# EAGLE design roduinoRF (EAGLE 6.2)
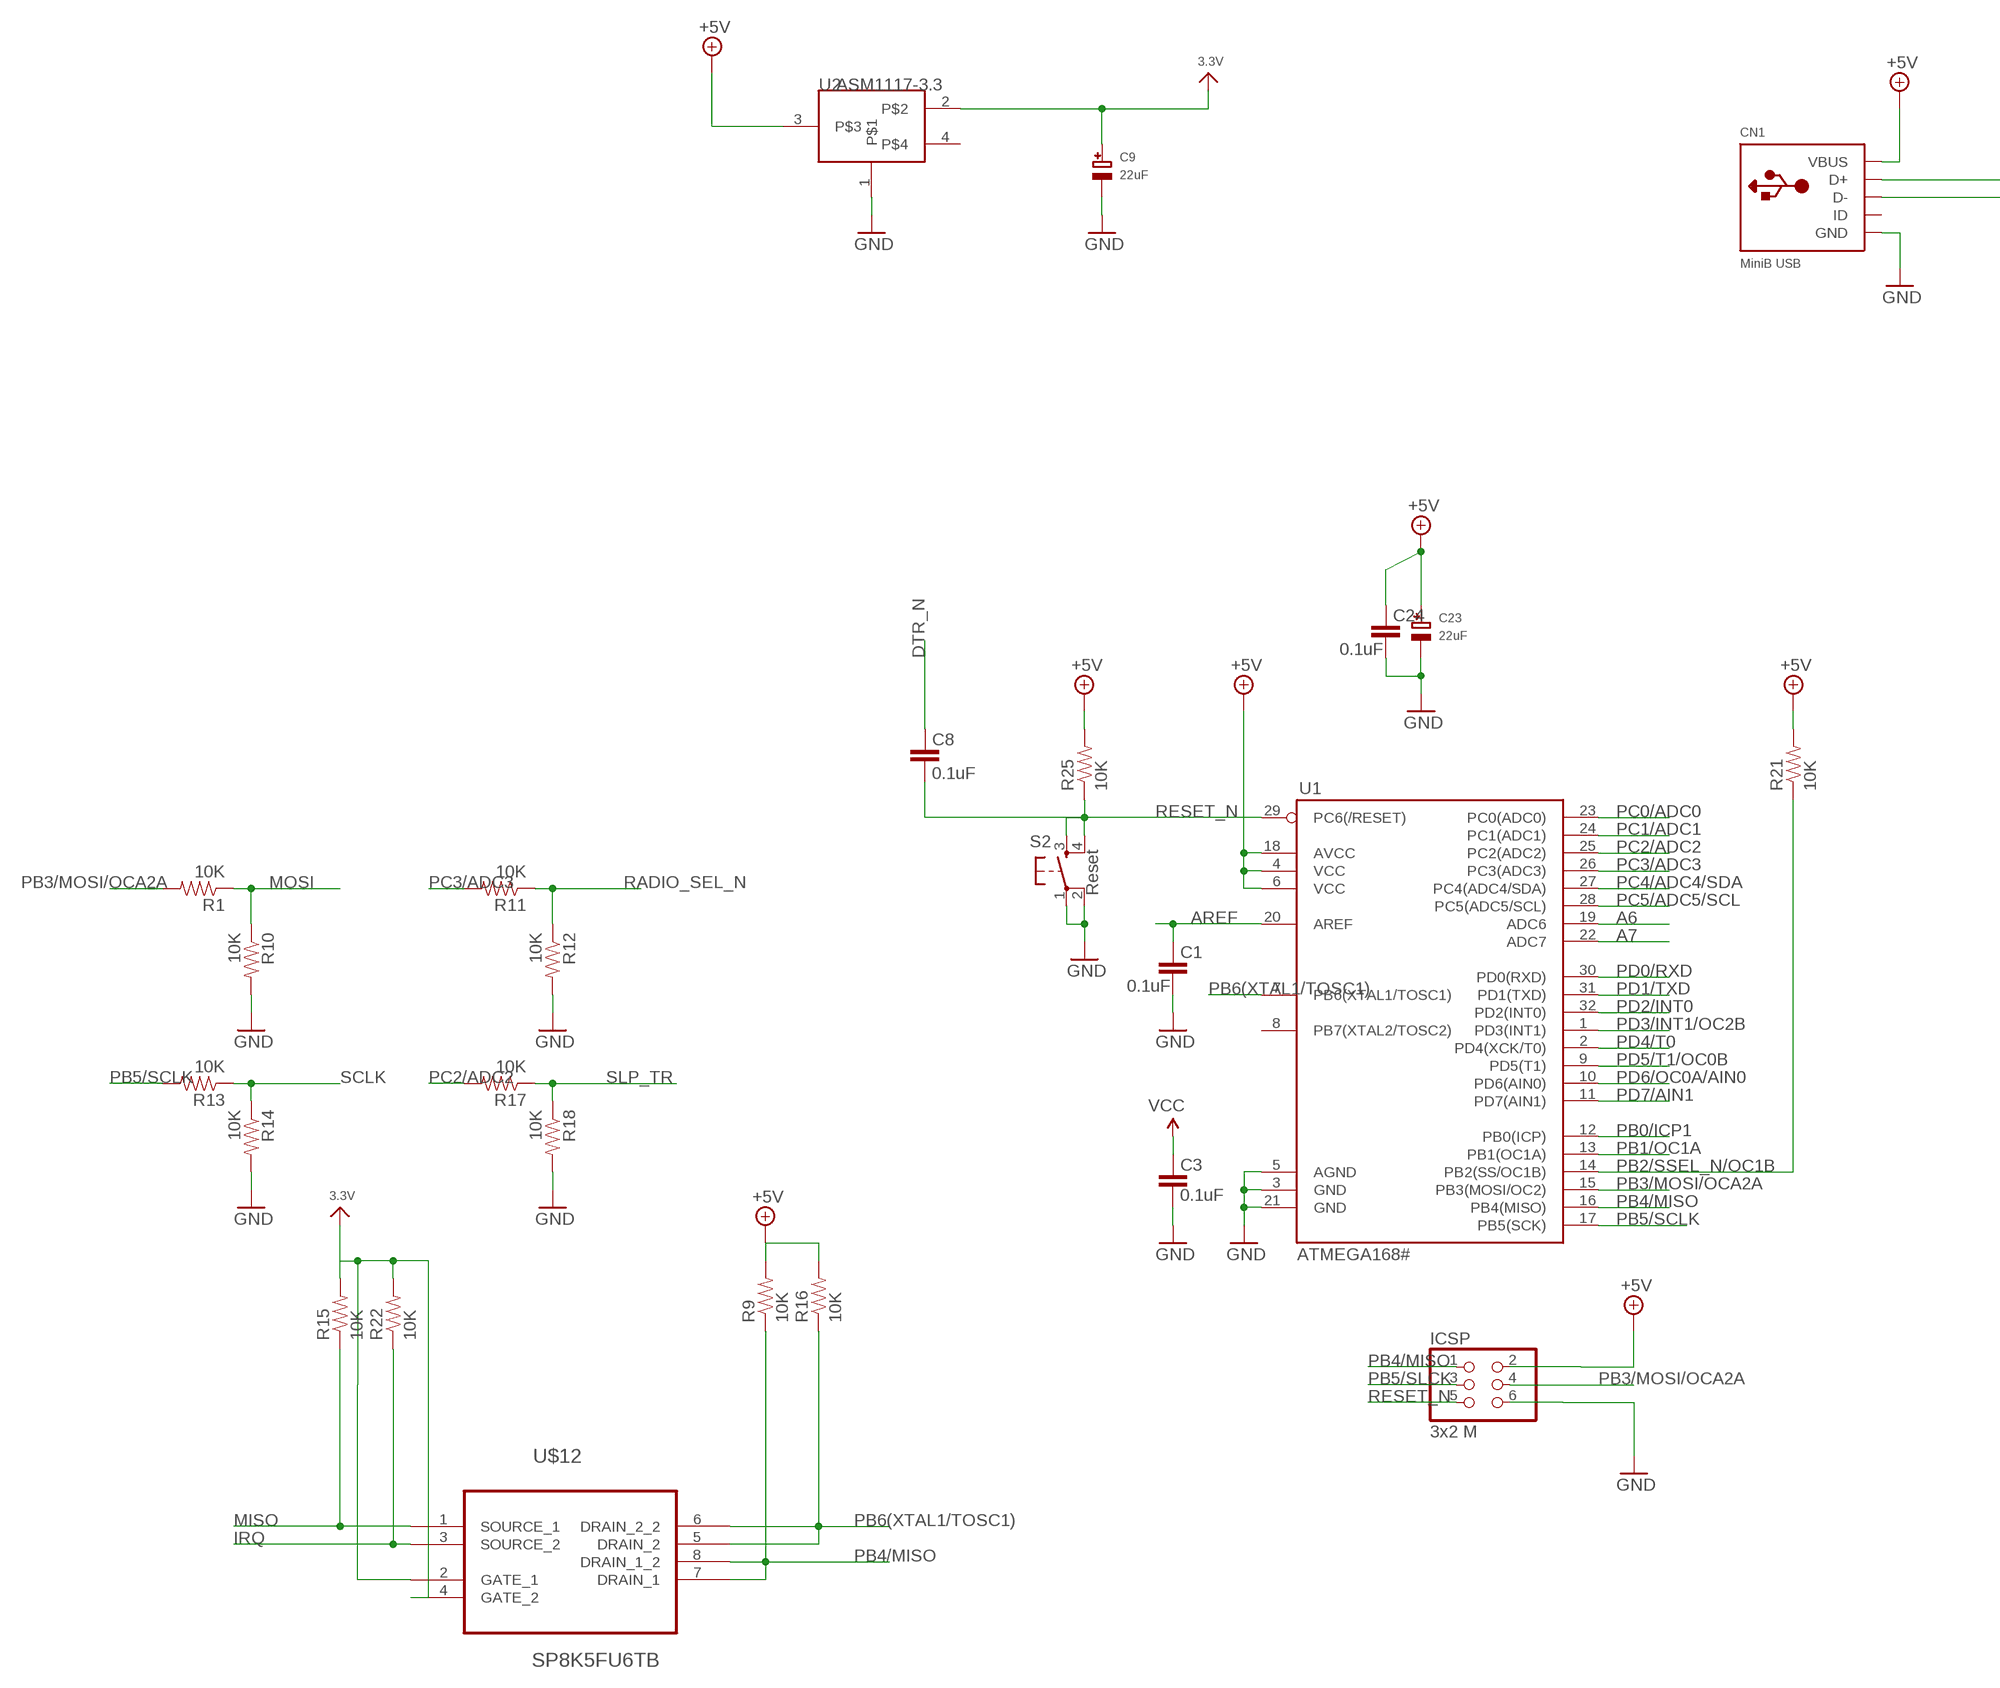
[diagram p0: schematic, sheet 1, part 1 of 2]
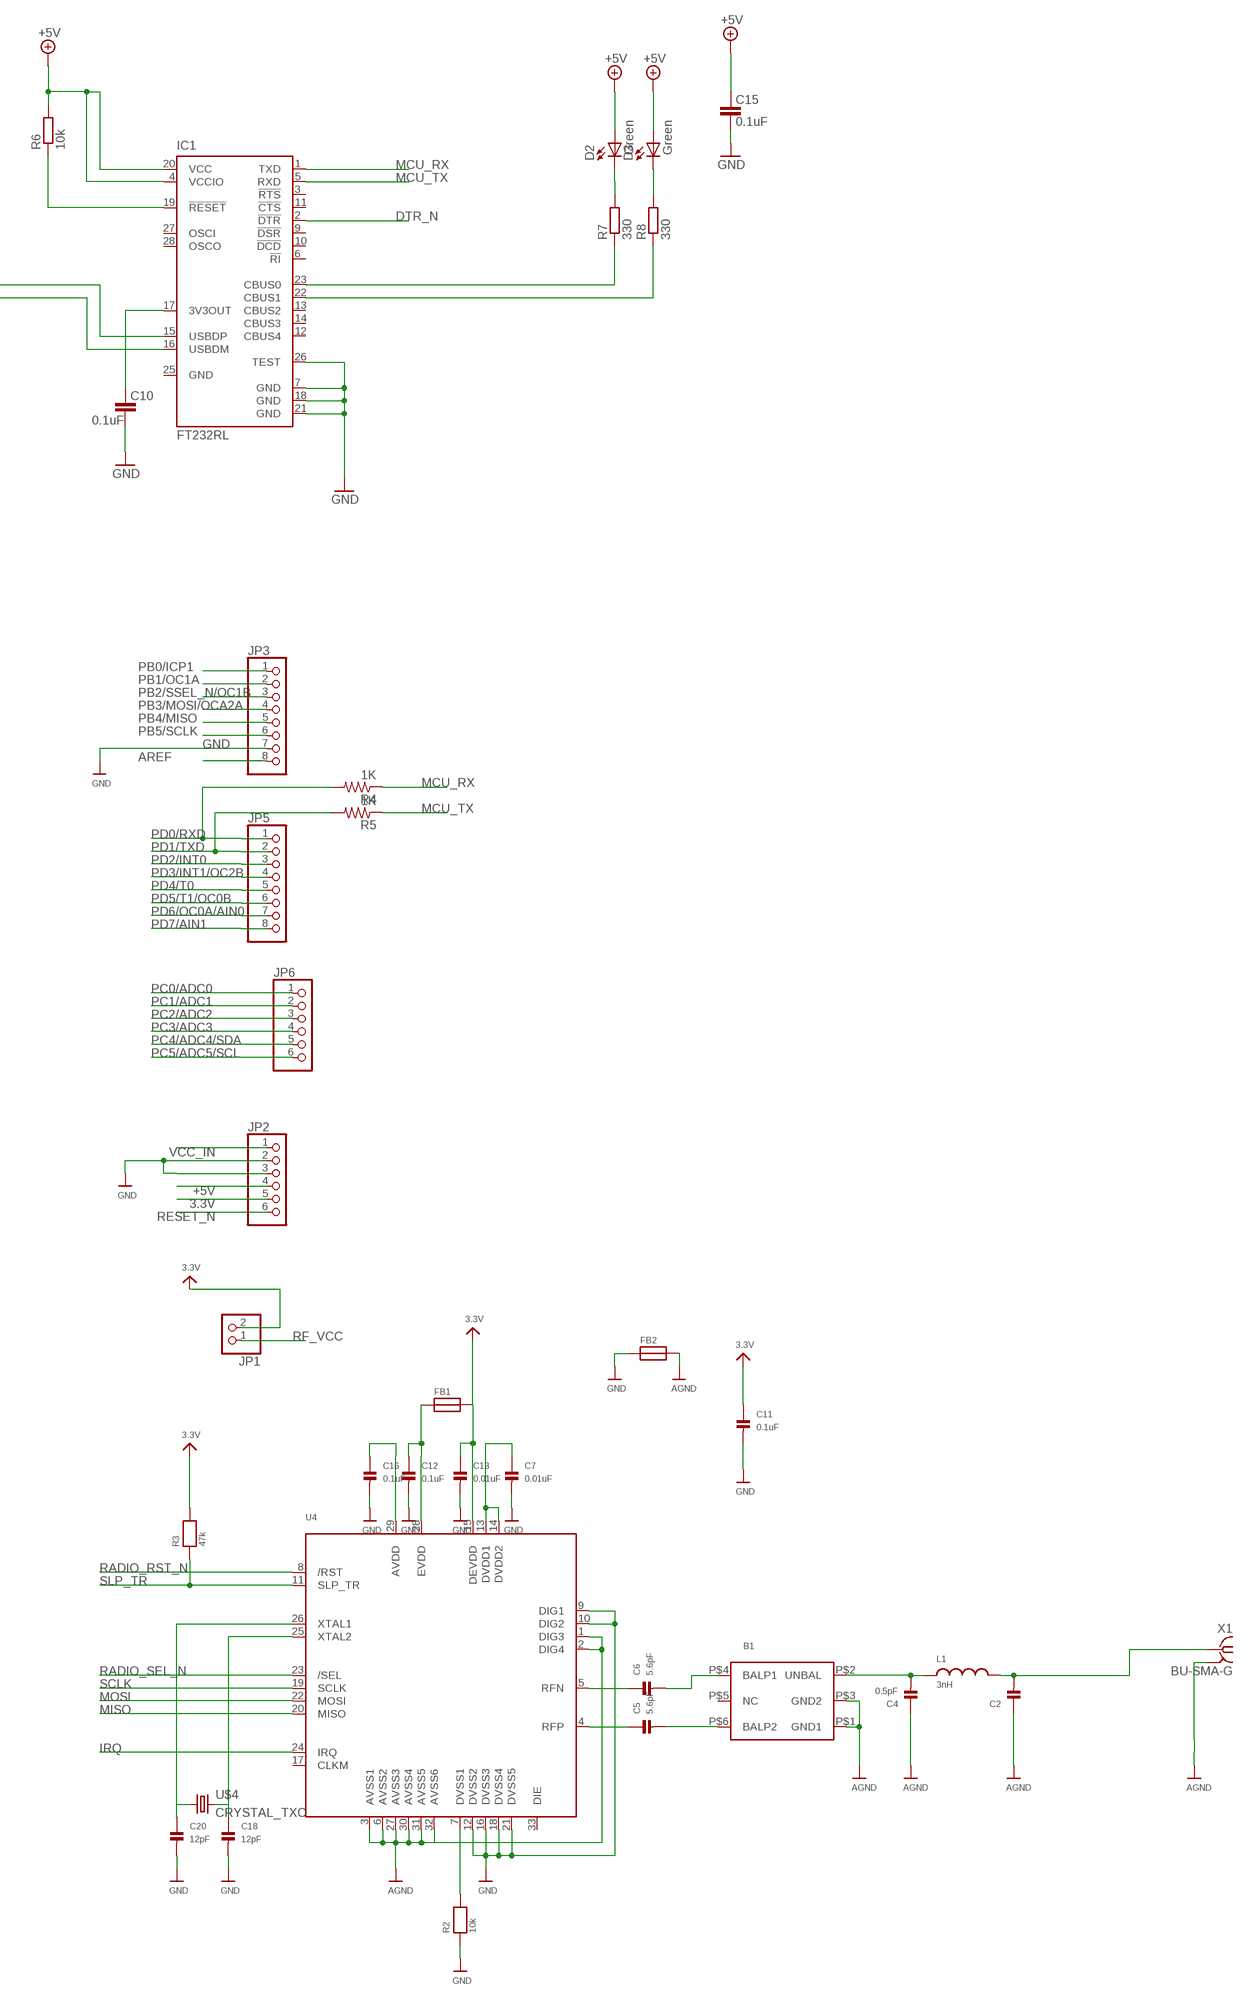
[diagram p1: schematic, sheet 1, part 2 of 2]

## Parts
B1  BALUN  [BALUN1206]
C1  0.1uF  CAP0805  [0805]
C2  CAP_CERAMIC0805  [0805]
C3  0.1uF  CAP0805  [0805]
C4  0.5pF  CAP_CERAMIC0805  [0805]
C5  5.6pF  CAP_CERAMIC0805  [0805]
C6  5.6pF  CAP_CERAMIC0805  [0805]
C7  0.01uF  CAP_CERAMIC0805  [0805]
C8  0.1uF  CAP0805  [0805]
C9  22uF  CAP_ELECTROLYTICPANASONIC_C  [PANASONIC_C]
C10  0.1uF  CAP0805  [0805]
C11  0.1uF  CAP_CERAMIC0805  [0805]
C12  0.1uF  CAP_CERAMIC0805  [0805]
C13  0.01uF  CAP_CERAMIC0805  [0805]
C15  0.1uF  CAP0805  [0805]
C16  0.1uF  CAP_CERAMIC0805  [0805]
C18  12pF  CAP_CERAMIC0805  [0805]
C20  12pF  CAP_CERAMIC0805  [0805]
C23  22uF  CAP_ELECTROLYTICPANASONIC_C  [PANASONIC_C]
C24  0.1uF  CAP0805  [0805]
CN1  MiniB USB  USBMINIB  [USB-MINIB]
D2  Green  LED0603  [LED-0603]
D3  Green  LED0603  [LED-0603]
FB1  FERRITE  [0603]
FB2  FERRITE  [0603]
IC1  FT232RL  [SSOP28]
ICSP  3x2 M  PINHD-2X3  [2X03]
JP1  PINHD-1X2  [1X02]
JP2  PINHD-1X6  [1X06]
JP3  PINHD-1X8  [1X08]
JP5  PINHD-1X8  [1X08]
JP6  PINHD-1X6  [1X06]
L1  3nH  INDUCTOR0805  [0805]
R1  10K  RESISTOR  [0805]
R2  10k  RESISTOR0805  [0805]
R3  47k  RESISTOR0805  [0805]
R4  1K  RESISTOR  [0805]
R5  1K  RESISTOR  [0805]
R6  10k  R-EU_R0603  [R0603]
R7  330  R-EU_R0805  [R0805]
R8  330  R-EU_R0805  [R0805]
R9  10K  RESISTOR  [0805]
R10  10K  RESISTOR  [0805]
R11  10K  RESISTOR  [0805]
R12  10K  RESISTOR  [0805]
R13  10K  RESISTOR  [0805]
R14  10K  RESISTOR  [0805]
R15  10K  RESISTOR  [0805]
R16  10K  RESISTOR  [0805]
R17  10K  RESISTOR  [0805]
R18  10K  RESISTOR  [0805]
R21  10K  RESISTOR  [0805]
R22  10K  RESISTOR  [0805]
R25  10K  RESISTOR  [0805]
S2  Reset  TAC_SWITCHSMD  [TACTILE_SWITCH_SMD]
U1  ATMEGA168#  ATMEGA168  [TQFP32-08]
U2  ASM1117-3.3  [SOT223]
U4  AT86RF212  [32QN2]
U$4  CRYSTAL_TXC  [CRYSTAL_TCX]
U$12  SP8K5FU6TB  [SOP127P600X175-8N]
X1  BU-SMA-G  [BU-SMA-G]

## Nets
3.3V: C9.+ JP1.2 JP2.5 R15.2 R22.2 U2.2 U$12.2(GATE_1) U$12.4(GATE_2)
+5V: C3.2 C15.2 C23.+ C24.2 CN1.VBUS D2.A D3.A IC1.4(VCCIO) IC1.20(VCC) ICSP.2 JP2.4 R6.2 R9.2 R16.2 R21.2 R25.2 U1.4(VCC) U1.6(VCC) U1.18(AVCC) U2.3 ; supply symbol labelled VCC
A6: U1.19(ADC6)
A7: U1.22(ADC7)
AGND: B1.P$1(GND1) B1.P$3(GND2) C2.1 C4.1 FB2.2 U4.1(DIG3) U4.2(DIG4) U4.3(AVSS1) U4.6(AVSS2) U4.27(AVSS3) U4.30(AVSS4) U4.31(AVSS5) U4.32(AVSS6) X1.2(GND)
AREF: C1.2 JP3.8 U1.20(AREF)
DTR_N: C8.2 IC1.2(!DTR)
GND: C1.1 C3.1 C7.2 C9.- C10.1 C11.2 C12.2 C13.2 C15.1 C16.2 C18.2 C20.2 C23.- C24.1 CN1.GND FB2.1 IC1.7(GND) IC1.18(GND) IC1.21(GND) IC1.26(TEST) ICSP.6 JP2.2 JP2.3 JP3.7 R2.1 R10.2 R12.2 R14.2 R18.2 S2.1 S2.2 U1.3(GND) U1.5(AGND) U1.21(GND) U2.1 U4.9(DIG1) U4.10(DIG2) U4.12(DVSS2) U4.16(DVSS3) U4.18(DVSS4) U4.21(DVSS5)
GND1: D2.C R7.2
IRQ: R22.1 U4.24(IRQ) U$12.3(SOURCE_2)
MCU_RX: IC1.1(TXD) R4.1
MCU_TX: IC1.5(RXD) R5.1
MISO: R15.1 U4.20(MISO) U$12.1(SOURCE_1)
MOSI: R1.1 R10.1 U4.22(MOSI)
N$1: CN1.D+ IC1.15(USBDP)
N$2: CN1.D- IC1.16(USBDM)
N$3: IC1.23(CBUS0) R7.1
N$4: IC1.19(!RESET) R6.1
N$5: IC1.22(CBUS1) R8.1
N$6: D3.C R8.2
N$12: C10.2 IC1.17(3V3OUT)
N$17: C6.1 U4.5(RFN)
N$20: C5.1 U4.4(RFP)
N$21: B1.P$4(BALP1) C6.2
N$22: B1.P$6(BALP2) C5.2
N$23: B1.P$2(UNBAL) C4.2 L1.1
N$24: C2.2 L1.2 X1.1
N$26: C20.1 U4.26(XTAL1) U$4.1
N$27: C18.1 U4.25(XTAL2) U$4.2
N$28: R2.2 U4.7(DVSS1)
N$29: C7.1 U4.13(DVDD1) U4.14(DVDD2)
N$30: C12.1 FB1.1 U4.28(EVDD)
N$31: C16.1 U4.29(AVDD)
PB0/ICP1: JP3.1 U1.12(PB0(ICP))
PB1/OC1A: JP3.2 U1.13(PB1(OC1A))
PB2/SSEL_N/OC1B: JP3.3 R21.1 U1.14(PB2(SS/OC1B))
PB3/MOSI/OCA2A: ICSP.4 JP3.4 R1.2 U1.15(PB3(MOSI/OC2))
PB4/MISO: ICSP.1 JP3.5 R9.1 U1.16(PB4(MISO)) U$12.7(DRAIN_1) U$12.8(DRAIN_1_2)
PB5/SCLK: JP3.6 R13.2 U1.17(PB5(SCK))
PB5/SLCK: ICSP.3
PB6(XTAL1/TOSC1): R16.1 U1.7(PB6(XTAL1/TOSC1)) U$12.5(DRAIN_2) U$12.6(DRAIN_2_2)
PC0/ADC0: JP6.1 U1.23(PC0(ADC0))
PC1/ADC1: JP6.2 U1.24(PC1(ADC1))
PC2/ADC2: JP6.3 R17.2 U1.25(PC2(ADC2))
PC3/ADC3: JP6.4 R11.2 U1.26(PC3(ADC3))
PC4/ADC4/SDA: JP6.5 U1.27(PC4(ADC4/SDA))
PC5/ADC5/SCL: JP6.6 U1.28(PC5(ADC5/SCL))
PD0/RXD: JP5.1 R4.2 U1.30(PD0(RXD))
PD1/TXD: JP5.2 R5.2 U1.31(PD1(TXD))
PD2/INT0: JP5.3 U1.32(PD2(INT0))
PD3/INT1/OC2B: JP5.4 U1.1(PD3(INT1))
PD4/T0: JP5.5 U1.2(PD4(XCK/T0))
PD5/T1/OC0B: JP5.6 U1.9(PD5(T1))
PD6/OC0A/AIN0: JP5.7 U1.10(PD6(AIN0))
PD7/AIN1: JP5.8 U1.11(PD7(AIN1))
RADIO_RST_N: U4.8(/RST)
RADIO_SEL_N: R11.1 R12.1 U4.23(/SEL)
RESET_N: C8.1 ICSP.5 JP2.6 R25.1 S2.3 S2.4 U1.29(PC6(/RESET))
RF_VCC: C11.1 C13.1 FB1.2 JP1.1 R3.2 U4.15(DEVDD) ; supply symbol labelled 3.3V
SCLK: R13.1 R14.1 U4.19(SCLK)
SLP_TR: R3.1 R17.1 R18.1 U4.11(SLP_TR)
VCC_IN: JP2.1
Unconnected: B1.P$5(NC) CN1.ID IC1.3(!RTS) IC1.6(!RI) IC1.9(!DSR) IC1.10(!DCD) IC1.11(!CTS) IC1.12(CBUS4) IC1.13(CBUS2) IC1.14(CBUS3) IC1.27(OSCI) IC1.28(OSCO) U1.8(PB7(XTAL2/TOSC2)) U2.4 U4.17(CLKM) U4.33(DIE)

## Power pins joined to a net without a drawn wire
GND: IC1.25(GND) X1.3(GND) X1.4(GND) X1.5(GND)

## Library data of the parts
B1 = microbuilder:BALUN: BALUN - Baluns for RF 1206 800-1000MHz Balun (1206) - Digikey: 712-1023-1-ND
C1 C3 C8 C10 C15 C24 = SparkFun:CAP: Capacitor Standard 0603 ceramic capacitor, and 0.1" leaded capacitor.
C2 C4-C7 C11-C13 C16 C18 C20 = microbuilder:CAP_CERAMIC: Ceramic Capacitors 0402 - 0402 Surface Mount Capacitors 16pF 50V 5% [Digikey: 445-4899-2-ND] 18pF 50V 5% [Digikey: 490-1281-2-ND] 22pF 50V 5% [Digikey: 490-1283-2-ND] 68pF 50V 5% [Digikey: 490-1289-2-ND] 0.1uF 10V 10% [Digikey: 490-1318-2-ND] 1.0uF 6.3V 10% [Digikey: 490-1320-2-ND] 0603 - 0603 Surface Mount Capacitors 16 pF 50V 5% [Digikey: 445-5051-2-ND] 22 pF 50V [Digikey: PCC220ACVTR-ND] 33 pF 50V 5% [Digikey: 490-1415-1-ND] 56pF 50V 5% [Digikey: 490-1421-1-ND] 220pF 50V 5% [Digikey: 445-1285-1-ND] 680 pF 50V 2200 pF 50V 5% C0G [Digikey: 445-1297-1-ND] 5600 pF 100V 5% X7R [Digikey: 478-3711-1-ND] 0.1 µF 25V 10% [Digikey: PCC2277TR-ND] 0.22 µF 16V 10% X7R [Digikey: 445-1318-1-ND] 1.0 µF 25V 10% [Digikey: 445-5146-2-ND] 0603 - RF Specific 3pF 250V +/-0.1pF RF [Digikey: 712-1347-1-ND] 18 pF 250V 5% [Digikey: 478-3505-1-ND or 712-1322-1-ND] 56 pF 250V 5% C0G RF [Digikey: 490-4867-1-ND] 68 pF 250V RF [Digikey: 490-4868-1-ND] 0805 - 0805 Surface Mount Capacitors 220 pF 250V 2% RF Ceramic Capacitor [Digikey: 712-1398-1-ND] 1000 pF 50V 2% NP0 Ceramic Capacitor [Digikey: 478-3760-1-ND] 0.1 µF 25V 10% Ceramic Capacitor [Digikey: PCC1828TR-ND] 1.0 µF 16V 10% Ceramic Capacitor[Digikey: 490-1691-2-ND] 10.0 µF 10V 10% Ceramic Capacitor[Digikey: 709-1228-1-ND] 10.0 uF 16V 10% Ceramic Capacitor [Digikey: 478-5165-2-ND] 47 uF 6.3V 20% Ceramic Capacitor [Digikey: 587-1779-1-ND or 399-5506-1-ND] 1206 - 1206 Surface Mount Capacitors 47uF 10V 20% Ceramic Capacitor [Digikey: 490-5528-1-ND or 399-5508-1-ND or 445-6010-1-ND]
C9 C23 = microbuilder:CAP_ELECTROLYTIC: Electrolytic Capacitors PANASONIC_C - Size C Panasonic Electrolytic Aluminum Capacitor 47µF 16V 20% Electrolytic Capacitor [Digikey: PCE3890TR-ND] PANASONIC_D - Size D Panasonic Electrolytic Aluminum Capacitor 100µF 25V 20% Electrolytic Capacitor [Digikey: PCE3898TR-ND]
CN1 = adafruit:USB: USB Connectors USBMINIB - Surface Mount Female Mini-B USB Connector 4UConnector: 06564 By microbuilder.eu Thru-hole RA Female Mini-B USB Connector 4UConnector: 18732 By ladyada.net
D2 D3 = SparkFun:LED: LEDs Standard schematic elements and footprints for 5mm, 3mm, 1206, and 0603 sized LEDs. 5mm - Spark Fun Electronics SKU : COM-00529 (and others)
FB1 FB2 = microbuilder:FERRITE: Ferrite Bead 0603 MMZ1608B121C - 120 Ohm, 600mA Ferrite Chip - Digikey: 445-2164-1-ND BK1608HW121-T - 120 Ohm, 600mA Ferrite Chip - Digikey: 587-1876-2-ND
IC1 = ftdichip:FT232R: Source: http://www.ftdichip.com/Documents/DataSheets/DS_FT232R_v104.pdf; MPN: FT232RL; OC_FARNELL: 1146032; OC_NEWARK: 91K9918
ICSP = SmartPrj:PINHD-2X3: PIN HEADER
JP1 = pinhead:PINHD-1X2: PIN HEADER
JP2 JP6 = pinhead:PINHD-1X6: PIN HEADER
JP3 JP5 = pinhead:PINHD-1X8: PIN HEADER
L1 = microbuilder:INDUCTOR: Inductors 0603: 10nH Ceramic Inductor - microwire antenna/RF (Digikey: 712-1434-2-ND) 0805: 560nH Ceramic Inductor - RF (Digikey: 553-1047-1-ND) 1007 (2518 Metric) SMT: 10µH 10% 250mOhm 820mA 1007 Inductor (Digikey: 587-2189-1-ND) 22µH 10% 500mOhm 580mA 1007 Inductor (Digikey: 587-2190-1-ND) 47µH 10% 950mOhm 420mA 1007 Inductor (Digikey: 587-2191-1-ND) 47µH 5% 100mOhm 1A 1008 Inductor (Digikey: 732-1816-1-ND) 6.0x6.0mm: 4.7µH 20% 3.8A 27mOhm Inductor (Digikey: 445-6538-2-ND)
R1 R4 R5 R9-R18 R21 R22 R25 = SparkFun:RESISTOR: Resistor Basic schematic elements and footprints for 0603, 1206, and PTH 1/10th watt (small) resistors.
R2 R3 = microbuilder:RESISTOR: Resistors 0402 - 0402 Surface Mount Package 22 Ohm 1% 1/16W [Digikey: 311-22.0LRTR-ND] 33 Ohm 5% 1/16W 1.0K 5% 1/16W 1.5K 5% 1/16W 2.0K 1% 1/16W 10.0K 1% 1/16W [Digikey: 311-10.0KLRTR-ND] 10.0K 5% 1/16W [Digikey: RMCF0402JT10K0TR-ND] 12.1K 1% 1/16W [Digikey: 311-22.0LRTR-ND] 100.0K 5% 1/16W 0603 - 0603 Surface Mount Package 0 Ohm 1/10 Watt 1% Resistor 15 Ohm 1/10 Watt 1% Resistor 33 Ohm 1/10 Watt 1% Resistor 49.9 Ohm 1/10 Watt 1% Resistor 100 Ohm 1/10 Watt 1% Resistor 150 Ohm 1/10 Watt 1% Resistor 240 Ohm 1/10 Watt 1% Resistor 390 Ohm 1/10 Watt 1% Resistor 560 Ohm 1/10 Watt 1% Resistor 680 Ohm 1/10 Watt 1% Resistor 750 Ohm 1/10 Watt 1% Resistor 1.0K Ohm 1/10 Watt 1% Resistor 1.5K Ohm 1/10 Watt 1% Resistor 2.0K Ohm 1/10 Watt 1% Resistor 2.2K Ohm 1/10 Watt 1% Resistor 3.3K Ohm 1/10 Watt 1% Resistor 4.7K Ohm 1/10 Watt 1% Resistor 10.0K Ohm 1/10 Watt 1% Resistor 12.0K Ohm 1/10 Watt 1% Resistor 12.1K Ohm 1/10 Watt 1% Resistor 20.0K Ohm 1/10 Watt 1% Resistor 33.0K Ohm 1/10 Watt 1% Resistor 100.0K Ohm 1/10 Watt 1% Resistor 0805 - 0805 Surface Mount Package 0 Ohm 1/8 Watt 1% Resistor 33 Ohm 1/8 Watt 1% Resistor 100 Ohm 1/8 Watt 1% Resistor 150 Ohm 1/8 Watt 1% Resistor 200 Ohm 1/8 Watt 1% Resistor 240 Ohm 1/8 Watt 1% Resistor 330 Ohm 1/8 Watt 1% Resistor 390 Ohm 1/8 Watt 1% Resistor 470 Ohm 1/8 Watt 1% Resistor 1.0K Ohm 1/8 Watt 1% Resistor 1.5K Ohm 1/8 Watt 1% Resistor 2.0K Ohm 1/8 Watt 1% Resistor 4.7K Ohm 1/8 Watt 1% Resistor 5.1K Ohm 1/8 Watt 1% Resistor 5.6K Ohm 1/8 Watt 1% Resistor 10.0K Ohm 1/8 Watt 1% Resistor 22.0K Ohm 1/8 Watt 1% Resistor 33.0K Ohm 1/8 Watt 1% Resistor 100K Ohm 1/8 Watt 1% Resistor 1206 - 1206 Surface Mount Package 2012 - 2010 Surface Mount Package 0.11 Ohm 1/2 Watt 1% Resistor - Digikey: RHM.11UCT-ND
R6-R8 = rcl:R-EU_: RESISTOR, European symbol
S2 = SparkFun:TAC_SWITCH: Momentary Switch Button commonly used for reset or general input. Spark Fun Electronics SKU : COM-00097
U1 = SparkFun:ATMEGA168
U2 = Itead_IC_110429:ASM1117-3.3: ICP006
U4 = microbuilder:AT86RF212: AT86RF212 - Low-Power SPI-based 700/800/900 MHz Transceiver Digikey: AT86RF212-ZU-ND
U$4 = crystal_txc:CRYSTAL_TXC: TXC - 7A-16.000MAAJ-T - XTAL, 16.000MHZ, 18PF, SMD, 5.0X3.2
U$12 = DUAL_MOSFET:SP8K5FU6TB
X1 = con-coax:BU-SMA-G: FEMALE SMA CONNECTOR Radiall distributor RS 193-9117; OC_FARNELL: unknown; OC_NEWARK: unknown

## Net classes
1 power: width 0.61 mm, drill 0.61 mm, clearance 0.254 mm
2 gnd: width 0.305 mm, drill 0.559 mm, clearance 0.254 mm
3 usbvcc: width 0.508 mm, drill 0.61 mm, clearance 0.254 mm

## Board
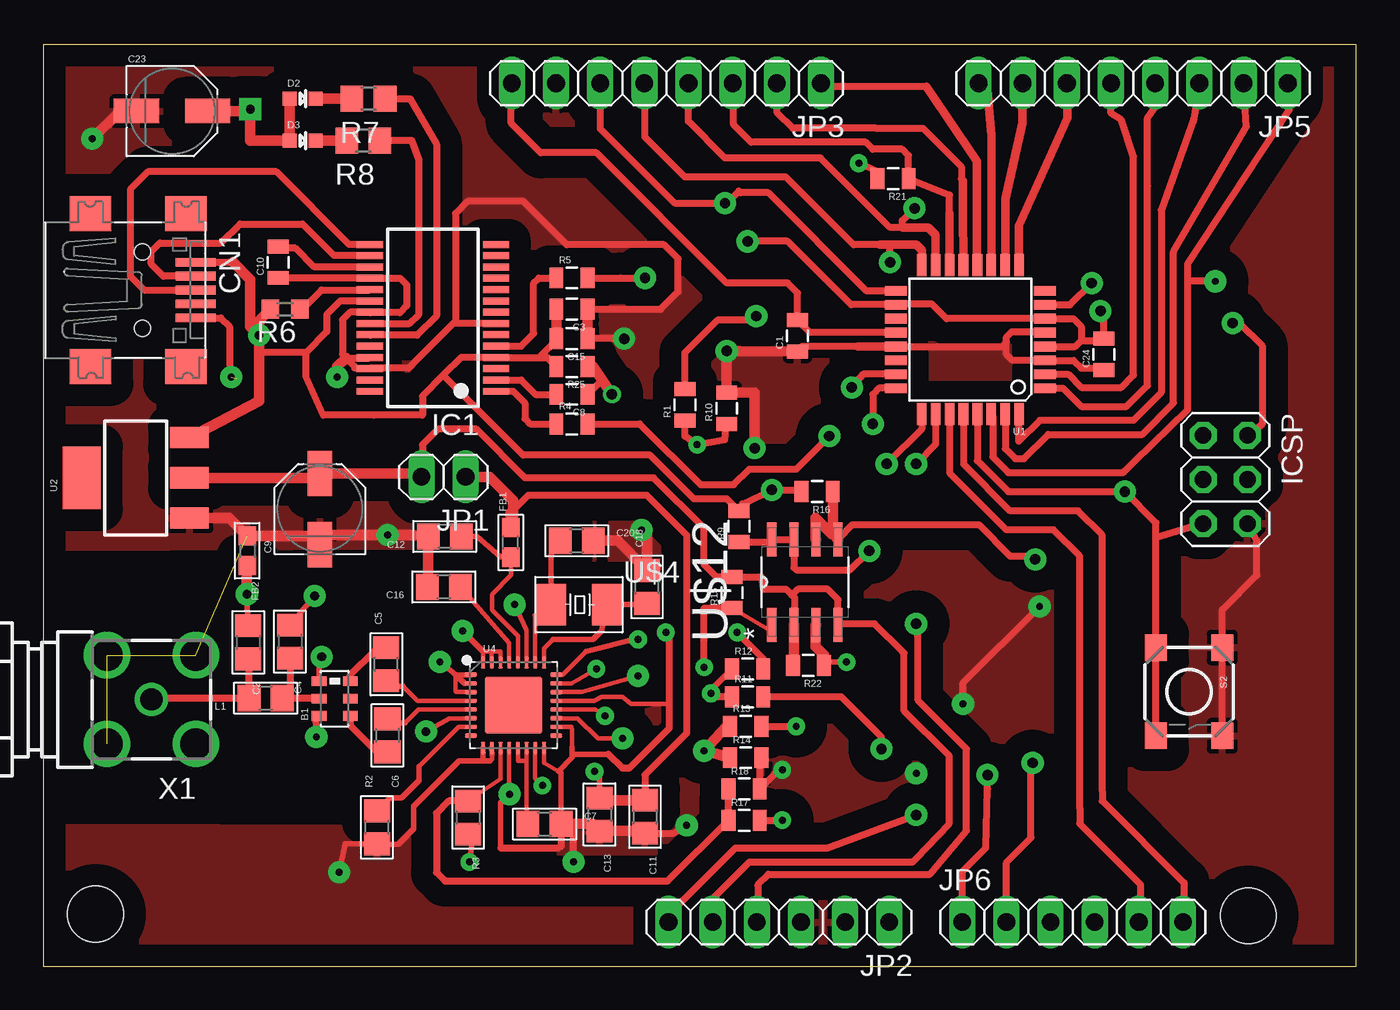
[diagram p2: board, top side]
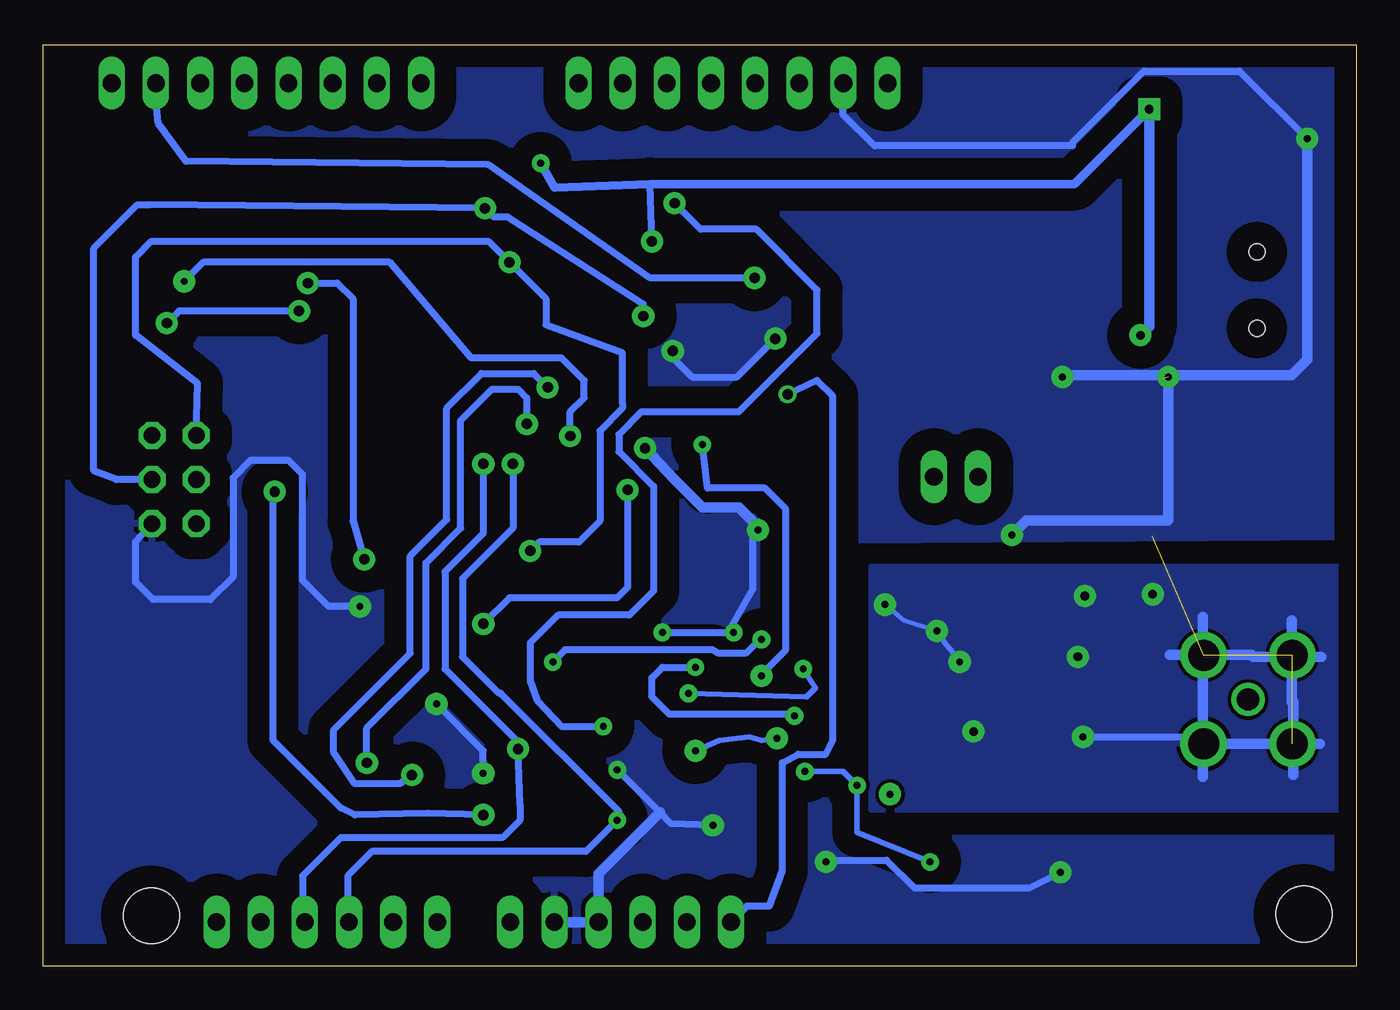
[diagram p3: board, bottom side, seen from below]

Size 75.5 x 53 mm. Coordinates in mm from the lower left corner, seen from the top.
Outline: 0,0 75.5,0 75.5,53 0,53 0,0
Copper layers (1*16): Top 0.035mm / dielectric 1.5mm / Bottom 0.035mm
Design rules: minimum track width 10mil, minimum drill 24mil, track to track 8mil, track to pad 8mil, pad to pad 8mil, via to via 8mil, smd to smd 8mil, copper to edge 40mil, drill to drill 8mil, minimum pad ring 10mil, minimum via ring 8mil, stop-mask expansion 4mil, vias tented up to drill 0mil, thermal gap 10mil
Holes 3.2 mm at 3,3 69.3,2.9

### Footprints (pad centres in the part's own frame; a part is rotated, then mirrored left to right if it is on the bottom)
BALUN1206 = smd 0.55 x 0.85: P$1 1,0.9; P$2 0,0.9; P$3 -1,0.9; P$4 -1,-0.9; P$5 0,-0.9; P$6 1,-0.9
0805 = smd 0.8 x 1.2: 1 -0.9,0; 2 0.9,0
0805' = smd 1.3 x 1.5: 1 -0.95,0; 2 0.95,0
PANASONIC_C = smd 2.6 x 1.4: + 2.05,0; - -2.05,0
USB-MINIB = smd 0.5 x 2.308: D+ 0,4.064; D- -0.8,4.064; GND 1.6,4.064; ID 0.8,4.064; VBUS -1.6,4.064 | smd 2 x 2.4: GND1 -4.4,-2; GND2 -4.4,3.5; GND3 4.4,3.5; GND4 4.4,-2 | hole 0.9: -2.2,1; 2.2,1
LED-0603 = smd 0.8 x 0.8: A 0,-0.75; C 0,0.75
0603 = smd 1.1 x 1: 1 -0.85,0; 2 0.85,0
SSOP28 = smd 0.4 x 1.5: 1 -4.225,-3.625; 2 -3.575,-3.625; 3 -2.925,-3.625; 4 -2.275,-3.625; 5 -1.625,-3.625; 6 -0.975,-3.625; 7 -0.325,-3.625; 8 0.325,-3.625; 9 0.975,-3.625; 10 1.625,-3.625; 11 2.275,-3.625; 12 2.925,-3.625; 13 3.575,-3.625; 14 4.225,-3.625; 15 4.225,3.625; 16 3.575,3.625; 17 2.925,3.625; 18 2.275,3.625; 19 1.625,3.625; 20 0.975,3.625; 21 0.325,3.625; 22 -0.325,3.625; 23 -0.975,3.625; 24 -1.625,3.625; 25 -2.275,3.625; 26 -2.925,3.625; 27 -3.575,3.625; 28 -4.225,3.625
2X03 = drill 0.95 pad 1.55 octagon: 1 -2.54,-1.27; 2 -2.54,1.27; 3 0,-1.27; 4 0,1.27; 5 2.54,-1.27; 6 2.54,1.27
1X02 = drill 1.016 long: 1 -1.27,0; 2 1.27,0
1X06 = drill 1.016 long: 1 -6.35,0; 2 -3.81,0; 3 -1.27,0; 4 1.27,0; 5 3.81,0; 6 6.35,0
1X08 = drill 1.016 long: 1 -8.89,0; 2 -6.35,0; 3 -3.81,0; 4 -1.27,0; 5 1.27,0; 6 3.81,0; 7 6.35,0; 8 8.89,0
R0603 = smd 1 x 1.1: 1 -0.85,0; 2 0.85,0
R0805 = smd 1.3 x 1.5: 1 -0.95,0; 2 0.95,0
TACTILE_SWITCH_SMD = smd 1.524 x 1.27: 1 -2.54,1.905; 2 2.54,1.905; 3 -2.54,-1.905; 4 2.54,-1.905
TQFP32-08 = smd 1.27 x 0.559: 1 -4.293,2.8; 2 -4.293,2; 3 -4.293,1.2; 4 -4.293,0.4; 5 -4.293,-0.4; 6 -4.293,-1.2; 7 -4.293,-2; 8 -4.293,-2.8; 17 4.293,-2.8; 18 4.293,-2; 19 4.293,-1.2; 20 4.293,-0.4; 21 4.293,0.4; 22 4.293,1.2; 23 4.293,2; 24 4.293,2.8 | smd 0.559 x 1.27: 9 -2.8,-4.293; 10 -2,-4.293; 11 -1.2,-4.293; 12 -0.4,-4.293; 13 0.4,-4.293; 14 1.2,-4.293; 15 2,-4.293; 16 2.8,-4.293; 25 2.8,4.293; 26 2,4.293; 27 1.2,4.293; 28 0.4,4.293; 29 -0.4,4.293; 30 -1.2,4.293; 31 -2,4.293; 32 -2.8,4.293
SOT223 = smd 1.219 x 2.235: 1 -2.311,-3.099; 2 0,-3.099; 3 2.311,-3.099 | smd 3.6 x 2.2: 4 0,3.099
32QN2 = smd 0.7 x 0.25: 1 -2.45,1.75; 2 -2.45,1.25; 3 -2.45,0.75; 4 -2.45,0.25; 5 -2.45,-0.25; 6 -2.45,-0.75; 7 -2.45,-1.25; 8 -2.45,-1.75; 17 2.45,-1.75; 18 2.45,-1.25; 19 2.45,-0.75; 20 2.45,-0.25; 21 2.45,0.25; 22 2.45,0.75; 23 2.45,1.25; 24 2.45,1.75 | smd 0.25 x 0.7: 9 -1.75,-2.45; 10 -1.25,-2.45; 11 -0.75,-2.45; 12 -0.25,-2.45; 13 0.25,-2.45; 14 0.75,-2.45; 15 1.25,-2.45; 16 1.75,-2.45; 25 1.75,2.45; 26 1.25,2.45; 27 0.75,2.45; 28 0.25,2.45; 29 -0.25,2.45; 30 -0.75,2.45; 31 -1.25,2.45; 32 -1.75,2.45 | smd 3.3 x 3.3: 33 0,0
CRYSTAL_TCX = smd 1.7 x 2.4: 1 -1.6,0; 2 1.6,0
SOP127P600X175-8N = smd 1.956 x 0.533: 1 -2.464,1.905; 2 -2.464,0.635; 3 -2.464,-0.635; 4 -2.464,-1.905; 5 2.464,-1.905; 6 2.464,-0.635; 7 2.464,0.635; 8 2.464,1.905
BU-SMA-G = drill 1.27: 1 0,0 | drill 1.778: 2 -2.55,2.55; 3 2.55,2.55; 4 2.55,-2.55; 5 -2.55,-2.55

### Placement (x,y rotation side)
B1  16.75,15.4 90 top
C1  43.37,36.27 90 top
C2  [0805']  11.78,18.63 270 top
C3  30.4,37.8 180 top
C4  0.5pF  [0805']  14.18,18.68 270 top
C5  5.6pF  [0805']  19.72,17.37 90 top
C6  5.6pF  [0805']  19.78,13.28 270 top
C7  0.01uF  [0805']  28.82,8.18 0 top
C8  30.4,32.9 180 top
C9  15.9,26.3 90 top
C10  13.5,40.5 90 top
C11  0.1uF  [0805']  34.6,8.6 270 top
C12  0.1uF  [0805']  23.08,24.72 180 top
C13  0.01uF  [0805']  31.98,8.73 270 top
C15  30.4,36.1 180 top
C16  0.1uF  [0805']  23.03,21.82 180 top
C18  12pF  [0805']  34.72,21.82 90 top
C20  12pF  [0805']  30.67,24.48 0 top
C23  7.4,49.2 0 top
C24  61,35.2 90 top
CN1  4.7,38.9 270 top
D2  14.9,49.9 270 top
D3  14.9,47.5 270 top
FB1  26.88,24.38 90 top
FB2  11.72,23.9 270 top
IC1  22.4,37.3 90 top
ICSP  67.98,28 270 top
JP1  23.01,28.15 180 top
JP2  42.3,2.54 180 top
JP3  35.84,50.8 180 top
JP5  62.68,50.8 180 top
JP6  59.2,2.54 0 top
L1  3nH  [0805']  12.78,15.42 180 top
R1  36.9,32.3 90 top
R2  10k  [0805']  19.18,7.99 90 top
R3  47k  [0805']  24.42,8.56 270 top
R4  30.4,31.2 0 top
R5  30.4,39.6 0 top
R6  13.9,37.8 180 top
R7  18.7,49.9 180 top
R8  18.4,47.5 180 top
R9  40,25.3 90 top
R10  39.3,32.1 90 top
R11  40.5,15.5 0 top
R12  40.5,17.1 0 top
R13  40.4,13.8 0 top
R14  40.4,12 0 top
R15  39.6,21.5 90 top
R16  44.5,27.3 180 top
R17  40.3,8.4 0 top
R18  40.3,10.2 0 top
R21  48.87,45.32 180 top
R22  44,17.3 180 top
R25  30.4,34.5 180 top
S2  65.9,15.8 270 top
U1  53.32,36.05 180 top
U2  5.3,28.1 90 top
U4  27.04,15.02 0 top
U$4  30.8,20.8 0 top
U$12  43.8,22.1 90 top
X1  6.21,15.34 180 top

### Tracks (layer width: path | path; a pad name or v marks a point on that pad's centre or on a via)
3.3V
  Top 0.406: 43.05,21.35 42.7,21.7 41.4,21.7 41.3,22.4 R15.2 38.7,22.4 38,23.1 38,25.2 35.1,28.1 27.7,28.1 24.9,30.9 22.7,30.9 21.8,30 21.8,28.21 JP1.2 | 43.05,21.35 43.2,21.2 43.2,19.67 U$12.2 | 43.05,21.35 43.4,21.7 45.1,21.7 45.7,21.09 U$12.4 45.77,19.7 47.8,19.7 49.4,18.1 49.5,18 49.5,14.7 52.1,12.1 52.1,8.2 50.2,6.2 50,6 40.6,6 38.49,3.89 JP2.5
  Top 0.61: U2.2 16.05,28.1 C9.+ 21.04,28.35 JP1.2 | U$12.2 43.16,17.36 R22.2
+5V  (via drill 0.4 pad 1.02, 0.5 pad 1.27, 0.6 pad 1.27)
  Top 0.254: R9.2 40.1,26.2 40.2,26.3
  Top 0.406: CN1.VBUS 10.9,40.5 | IC1.20 17.07,38.27 16.3,37.5 16.3,36.5 15.1,35.3 | 15.1,35.3 12.6,35.3 12.4,35.5 | 23,34 24.02,35.02 IC1.4 28.5,35.02 | 23,34 21.8,32.8 21.8,31.7 19,31.7 16.1,31.7 15.1,33.9 15.1,35.3 | 28.5,35.02 28.98,35.02 R25.2 | C15.2 29.5,36.02 28.5,35.02 | 41.9,27.6 v41.9,27.4 | v41.9,27.4 43.5,27.4 R16.2 | 23,34 27.6,29.4 34.9,29.4 37.4,26.9 39.3,26.9 R9.2 | U1.4 59.35,35.65 59.7,36 | 59.7,36 60.9,36 C24.2 61,37.5 v60.8,37.7 | 59.7,36 59.7,36.8 59.25,37.25 U1.6 51.95,37.25 51.1,38.1 49.07,38.1 U1.18 46.45,38.05 42.8,41.7 v40.5,41.7 | R21.2 47.98,45.72 v46.9,46.2 | JP2.4 41.1,2.61 41.1,4.6 41.1,4.7 41.7,5.3 51,5.3 53.1,7.8 53.1,12.5 50.3,15.3 50.3,19.6 v50.2,19.7 | 40.2,26.3 40.2,26.6 v41.9,27.4 | v68.4,37 68.8,37 70.1,35.7 70.1,31.17 ICSP.2
  Top 0.61: D2.A D3.A 11.9,47.5 v11.9,49.3 11.8,49.2 C23.+ | v12.4,36.3 12.4,37.15 R6.2 | 10.9,40.5 11.9,39.5 11.9,36.8 v12.4,36.3 | v12.4,36.3 12.4,35.5 12.4,32.51 U2.3 | C15.2 C3.2
  Bottom 0.406: v40.5,41.7 40.6,45 46.1,44.8 | v41.9,27.4 41.9,21.8 42.5,21.2 46,21.2 48.7,21.2 v50.2,19.7 | v60.8,37.7 67.7,37.7 v68.4,37
  Bottom 0.5: v46.9,46.2 46.1,44.8 40.6,45 16.2,45 v11.9,49.3
  Bottom 0.61: v11.9,49.3 11.9,36.8 v12.4,36.3
AGND  (via drill 0.4 pad 1.27, 0.5 pad 1.27)
  Top 0.254: U4.32 25.29,18.11 25.3,18.1 25.8,18.1 | U4.2 24.23,16.27 | U4.3 23.73,15.77 23.7,15.8 23.7,16.74 | U4.6 23.37,14.27 v22,13.5 | U4.27 27.79,19.31 v27.1,20.8 | U4.30 26.29,18.09 26.3,18.1 25.8,18.1 | U4.31 25.79,18.09 25.8,18.1
  Top 0.305: 25.29,18.11 v24.1,19.3 | U4.1 23.73,16.77 | 23.73,16.77 v22.8,17.5 | B1.P$1 15.85,17.65 v16,17.8 | C4.1 15.58,21.28 v15.6,21.3 | C2.1 11.68,21.38 v11.7,21.4 | 24.23,16.27 23.73,16.77 | 23.7,16.74 23.73,16.77
  Top 0.406: B1.P$3 15.65,14.25 v15.7,13.2
  Top 0.61: v11.7,21.4 11.7,23.03 FB2.2
  Bottom 0.254: v27.1,20.8 26,19.9 v24.1,19.3
  Bottom 0.305: v24.1,19.3 23.6,18.5 23.3,18.2 v22.8,17.5 | v11.7,21.4 12.1,21.4 11.9,21.2 | v22,13.5 22.5,13.6
  Bottom 0.406: v15.7,13.2 9.17,13.2 X1.2
  Bottom 0.61: 3.6,12.8 3.7,12.8 | 3.7,12.8 8.6,12.8 | 3.7,12.8 2.1,12.8 | 3.6,11 3.6,15.2 3.7,15.2 3.7,19.9 | 8.8,10.9 8.8,20 8.8,20.1 | 5.9,17.8 2,17.8 | 6,17.9 10.7,17.9
  pour Bottom: 0.5,9 27.9,9 27.9,23 0.7,23
AREF
  Top 0.406: U1.20 44.09,36.45 C1.2 43.37,38.73 42.8,39.3 39.3,39.3 31.8,46.8 28.6,46.8 26.9,48.5 26.9,50.75 JP3.8
DTR_N
  Top 0.406: IC1.2 27.48,33.73 28.3,32.9 C8.2
GND  (via drill 0.4 pad 1.02, 0.4 pad 1.27, 0.6 pad 1.27)  (4 unrouted)
  Top 0.254: 25.7,11.8 25.8,11.9 25.8,12.16 | 29.62,11.22 28.8,11.7 U4.16 | U4.18 30.37,13.77 30.4,13.6 30.4,12.6 | U4.12 26.79,9.89 | 30.5,8.3 30.42,8.3 30.3,8.18 | 25.29,11.91 25.29,11.81 25.3,11.8 | U4.21 31.67,15.27 32.1,15.5 33.3,15.5 33.8,15.1 35.9,15.1 36,15
  Top 0.305: U4.9 25.29,11.91 | 25.7,11.8 25.4,11.8 25.3,11.8 23.9,11.8 21.3,9.2 21.3,7.9 20.4,7 19.22,7 R2.1 17.34,7.04 v17,5.4 | 25.8,12.16 U4.10 | U4.16 | 30.4,12.2 30.4,12.6 30.4,12.2 | 30.4,12.2 30.4,12 29.62,11.22 29.77,11.13 C7.2 29.8,8.15 | 26.79,9.89 26.3,9.4 26.3,6.8 | 32.5,12.2 30.4,12.2 | 17.88,34.38 17.95,34.45
  Top 0.406: C10.1 13.53,39.58 IC1.18 20.52,39.58 20.9,39.2 20.9,38 20.5,37.6 18.8,37.6 IC1.21 17.62,37.62 17.2,37.2 17.2,35.2 17.4,35 | 17.4,35 18.75,35 IC1.25 | 17.4,35 17.95,34.45 18.02,34.38 IC1.26 18.8,34.4 21,34.4 23.57,36.98 | 26.3,6.8 29.6,6.8 29.8,6.9 29.8,8.15 C7.2 | IC1.7 23.57,36.98 | CN1.GND 10.2,37.3 10.7,36.8 10.7,34 v10.8,33.9 | v30.5,6 30.5,8.3 | C11.2 36.25,7.65 v37,8.1 | v42.5,11.3 42.3,11.3 R18.2 41.2,11.9 R14.2 | R12.2 41.4,17.7 v39.9,19.2 | C24.1 60.9,34.4 59.7,34.4 59.25,34.85 U1.3 55.75,34.85 55.4,35.2 55.4,35.9 | 55.4,35.9 55.4,36.2 55.7,36.5 57.56,36.5 U1.5 | v33.4,36.1 C15.1 | 46.85,35.65 43.65,35.65 C1.1 | U1.21 55.15,35.65 55.4,35.9 | S2.2 S2.1 67.81,20.5 69.8,22.5 69.8,24.49 ICSP.6 | 11.1,33.8 11.2,33.7 | C3.1 35.5,37.8 36.5,38.8 36.5,40.7 35.7,41.5 30.1,41.5 27.6,44 24.4,44 23.7,43.3 23.7,37.1 23.57,36.98 | 32.5,12.2 33.3,11.4 33.7,11.4 36,13.7 36,15 36,19 v35.8,19.2 | v52.9,15.1 52.9,16.3 v57.3,20.7
  Top 0.5: U1.21 46.85,35.65
  Top 0.61: C7.2 30.3,8.18 31.58,8.18 C13.2 34.47,7.78 C11.2 | C20.2 33.01,24.48 C18.2 34.72,24.78 v34.4,25.1 | U2.1 10.68,25.79 FB2.1 15.4,24.75 C9.- 16.45,24.8 v19.8,24.8 21.05,24.8 C12.2 22.13,22.27 C16.2 | v2.8,47.6 4.4,49.2 C23.- 5.4,49.25 | C15.1 C3.1 | C1.1 v39.3,35.4 R10.2 40.9,33 v40.9,29.8 | 16.9,34 v16.9,33.9 16.9,34 | 16.9,34 16.9,34.5 17.4,35
  Bottom 0.406: 30.5,6.1 27,6.1 25.4,4.5 18.8,4.5 v17,5.4 | v37,8.1 39.4,8.2 40.05,8.85 42.4,11.2 v42.5,11.3 | v39.9,19.2 36.1,19.2 35.96,19.46 | 35.96,19.46 34.7,21.7 34.7,24.8 v34.4,25.1 | v39.3,35.4 39.3,35 38.2,33.9 35.6,33.9 v33.4,36.1 | v35.8,19.2 36,19.2 35.96,19.46 | v50.2,11.1 50.2,12.4 v52.9,15.1 | v57.3,20.7 59.1,20.7 60.6,22.2 60.6,28.3 61.4,29.1 63.6,29.1 64.6,28.1 64.6,22.4 65.9,21.1 69.2,21.1 70.2,22.1 70.2,24.43 ICSP.6 | JP3.7 29.5,50.79 29.5,49 27.7,47.2 16.3,47.2 16.3,47.4 12.2,51.5 6.7,51.5 v2.8,47.6
  Bottom 0.61: 40.05,8.85 42.4,6.5 43.57,5.33 JP2.3 JP2.2 | v10.8,33.9 10.8,25.67 10.84,25.64 18.96,25.64 v19.8,24.8 | v2.8,47.6 2.8,34.9 3.7,34 17,34 v16.9,33.9 | v34.4,25.1 34.4,25.3 35.5,26.4 37.6,26.4 39.2,28 v40.9,29.8
  pour Bottom (isolate 1.27): 0.7,0.2 99.8,0.2 99.4,55.7 0.1,55.7 0.3,24.7 29.1,24.5 28.9,7.4 0.8,7.4 0.5,0.1
  pour Top (isolate 1.27): 0.8,0.5 99.6,0.5 98.9,57.4 0.1,57.4 0.2,24.1 28.6,24.2 28.6,7.9 0.9,8 0.8,0.6
GND1
  Top 0.61: R7.2 D2.C
IRQ  (via drill 0.4 pad 1.02)
  Top 0.254: U4.24 29.87,16.77 31.2,18.1
  Top 0.305: 31.2,18.1 34.3,18.9 v34.2,18.8 | v46.2,17.5 44.7,17.5 R22.1
  Top 0.61: R22.1 44.9,17.9 44.4,18.4 44.4,19.6 U$12.3
  Bottom 0.305: 45.5,18.2 v46.2,17.5
  Bottom 0.406: v46.2,17.5 45.5,18.2 45.4,18.2 37,18.2 36.7,18 35.1,18 34.3,18.8 v34.2,18.8
MCU_RX
  Top 0.406: IC1.1 27.02,33.08 27.7,32.4 27.7,31.5 28,31.2 R4.1
MCU_TX
  Top 0.406: IC1.5 27.48,35.67 28.2,36.4 28.2,39.3 28.5,39.6 R5.1
MISO  (via drill 0.4 pad 1.02)
  Top 0.254: U4.20 31.73,14.77 v32.3,14.4 | R15.1 41.66,19.4 U$12.1
  Top 0.406: v38,17.2 38,18.9 38,20.6 39.7,20.6 R15.1
  Bottom 0.254: v32.3,14.4 32.8,14.5
  Bottom 0.406: 32.8,14.5 39.5,14.5 40.5,15.5 40.5,16.6 39.9,17.2 v38,17.2
MOSI  (via drill 0.4 pad 1.02, 0.4 pad 1.27)
  Top 0.254: U4.22 30.97,15.77 v34.2,16.7
  Top 0.406: R10.1 39.2,30.3 v37.6,30 36.9,30.5 R1.1
  Bottom 0.406: v37.6,30 37.3,27.5 34,27.5 32.8,26.3 32.8,18.2 34.2,16.8 v34.2,16.7
N$1
  Top 0.406: IC1.15 17.57,41.52 13.4,45.7 6,45.7 5,44.7 5,39.7 5.8,38.9 CN1.D+
N$2
  Top 0.406: CN1.D- 6.9,39.7 6.2,40.4 6.2,41.1 6.7,41.6 10.2,41.6 11.3,42.7 14.9,42.7 16.7,40.9 18.75,40.9 IC1.16
N$3
  Top 0.406: R7.1 21.1,49.9 22.6,47.3 22.6,37.4 21.5,36.3 18.8,36.3 IC1.23
N$4
  Top 0.406: R6.1 14.9,37.8 16,38.9 18.75,38.9 IC1.19
N$5
  Top 0.406: IC1.22 21.07,36.98 21.6,37.5 21.6,46.4 21.2,47.5 R8.1
N$6
  Top 0.61: R8.2 D3.C
N$7  (via drill 0.4 pad 1.27)
  other vias: 26.8,9.9
N$12
  Top 0.406: IC1.17 15.57,40.23 14.5,41.3 13.6,41.3 C10.2
N$17
  Top 0.254: U4.5 21.57,14.77 20.8,14
  Top 0.305: 20.8,14 20.01,14 C6.1
N$20
  Top 0.254: U4.4 21.53,15.27 20.7,16.1
  Top 0.305: 20.7,16.1 20.04,16.1 C5.1
N$21
  Top 0.406: B1.P$4 17.65,13.85 19.1,12.4 19.71,12.4 C6.2
N$22
  Top 0.406: B1.P$6 17.65,16.75 19.1,18.2 19.6,18.2 C5.2
N$23
  Top 0.406: C4.2 14.18,15.87 L1.1 13.75,15.4 B1.P$2
N$24
  Top 0.406: C2.2 11.83,17.63 L1.2 6.29,15.42 X1.1
N$26
  Top 0.254: U4.26 28.29,20.19
  Top 0.305: 28.29,20.19 U$4.1 29.2,23.66 C20.1
N$27
  Top 0.254: U4.25 28.79,18.29 29.3,18.8
  Top 0.305: C18.1 34.65,20.8 U$4.2 32.1,19.3 31.6,18.8 29.3,18.8
N$28
  Top 0.254: U4.7 23.87,13.77 22.8,12.7 21.6,11.5
  Top 0.305: 21.6,11.5 21.6,10.7 20.6,9.7 19.94,9.7 R2.2
N$29
  Top 0.254: U4.14 27.79,11.8 | 27.79,11.8 27.79,8.26 | U4.13 27.29,11.81 27.3,11.8 27.79,11.8
  Top 0.305: 27.79,8.26 C7.1
N$30
  Top 0.254: U4.28 27.29,18.81 27.29,19.01 25.8,20.5 25.8,21.4 26.9,22.5 26.9,23.51 FB1.1
  Top 0.305: 26.9,23.51 FB1.1 26.3,23.53 24.94,24.73 C12.1
N$31
  Top 0.254: U4.29 26.79,18.61 C16.1
PB0/ICP1
  Top 0.406: 50.79,50.61 44.92,50.61 JP3.1
  Top 0.5: 50.79,50.61 53.7,46.3 53.7,42.5 53.7,41.3 53.7,40.36 U1.12
PB1/OC1A
  Top 0.406: 52.9,45.2 52.8,45.3 52.8,46 50.6,48.2 47.9,48.2 43.1,48.2 42.2,49.1 42.2,50.79 JP3.2
  Top 0.5: U1.13 52.92,41.62 52.9,42.3 52.9,45.2
PB2/SSEL_N/OC1B
  Top 0.406: 52.12,43.33 52.12,44.37 R21.1 49.77,46.63 49.4,47 47.7,47 47.3,47.4 40.7,47.4 39.7,48.4 39.7,50.75 JP3.3
  Top 0.5: U1.14 52.12,43.33
PB3/MOSI/OCA2A  (via drill 0.6 pad 1.27)
  Top 0.406: v50.1,43.6 49.4,42.9 49.4,42.5 48.7,42.5 44.7,46.5 39.2,46.5 37.1,48.6 JP3.4 | R1.2 36.9,35.3 38.8,37.2 40.8,37.2 v41,37.4
  Top 0.5: U1.15 51.32,42.08 50.9,42.5 49.4,42.5
  Bottom 0.406: v41,37.4 41,38.1 48.8,43.1 49.6,43.1 v50.1,43.6 69.4,43.8 70.1,43.8 72.6,41.3 72.6,28.5 71.3,28 ICSP.4
PB4/MISO  (via drill 0.6 pad 1.27)
  Top 0.406: R9.1 41.73,24.4 U$12.8 U$12.7 43.16,22.93 43.3,22.8 46.4,22.8 v47.5,23.9 | v48.7,40.5 48.7,41.4 48.8,41.5 | 48.1,41.5 46.6,41.5 42.7,45.4 36.9,45.4 34.6,47.7 34.6,50.77 JP3.5
  Top 0.5: U1.16 50.52,41.18 50.2,41.5 48.8,41.5 48.1,41.5
  Bottom 0.406: v47.5,23.9 47,24.4 44.7,24.4 43.5,25.6 43.5,30.8 42.2,32.1 42.2,32.4 42.2,33.7 42.2,35.3 46.6,36.9 46.6,38.4 v48.7,40.5 49.9,41.7 69.3,41.7 70.2,40.8 70.2,36.3 66.63,33.53 ICSP.1
PB5/SCLK  (via drill 0.4 pad 1.02, 0.6 pad 1.27)
  Top 0.406: R13.2 v43.3,13.8 | U1.17 47.35,38.85 41.7,44.5 40.1,44.5 40,44.6 39.3,43.9 v39.2,43.9 36.3,43.9 32.03,48.17 JP3.6
  Bottom 0.406: v39.2,43.9 37.7,42.4 34.5,42.4 31,38.9 31,36.4 35.5,31.9 41.1,31.9 42.4,30.6 42.4,29.6 40.4,27.6 40.4,21.6 41.8,20.2 45.9,20.2 47.5,18.6 47.5,16.4 47.1,15.3 45.7,13.8 v43.3,13.8
PB6(XTAL1/TOSC1)  (via drill 0.6 pad 1.27)
  Top 0.406: U1.7 59.05,38.05 v60.3,39.3 | U$12.5 46.54,25.4 53.8,25.4 55.6,23.6 56.86,23.6 v57.05,23.41
  Top 0.61: R16.1 45.4,24.87 | 45.4,24.87 U$12.5 | 45.4,24.87 45.33,24.87 44.4,25.8 44.4,24.6 U$12.6
  Bottom 0.406: v60.3,39.3 58.6,39.3 57.7,38.4 57.7,25.6 v57.05,23.41
PC0/ADC0  (via drill 0.6 pad 1.27)
  Top 0.406: U1.23 47.15,34.05 v46.5,33.3 | v54.3,11 54.3,10.2 54.2,6.8 52.85,5.45 JP6.1
  Bottom 0.406: v54.3,11 54.2,11.1 55,10.5 57.6,10.5 58.8,12.3 58.8,13.6 54.4,18 54.4,23.6 52.3,25.7 52.3,32.1 50.3,34.1 47.3,34.1 v46.5,33.3
PC1/ADC1  (via drill 0.6 pad 1.27)
  Top 0.406: U1.24 48.05,33.25 47.7,32.9 47.7,31.5 v47.7,31.2 | v56.9,11.7 56.8,11.6 56.8,7.4 55.39,5.99 JP6.2
  Bottom 0.406: v56.9,11.7 56.9,13.7 53.5,17.1 53.5,23.2 51.5,25.2 51.5,31.4 49.7,33.2 48.2,33.2 47.7,32.7 v47.7,31.2
PC2/ADC2  (via drill 0.4 pad 1.02, 0.6 pad 1.27)
  Top 0.406: R17.2 v42.5,8.4 | U1.25 50.52,30.92 v48.5,28.9
  Bottom 0.406: v48.5,28.9 48.5,25.2 51.4,22.3 51.4,17.8 49.3,15.7 49.2,15.7 42.4,8.9 42.4,8.5 v42.5,8.4 44.3,6.6 56.6,6.6 58,5.2 58,2.61 JP6.3
PC3/ADC3  (via drill 0.6 pad 1.27)
  Top 0.406: U1.26 51.32,30.02 v50.2,28.9 | v48.2,12.5 48.2,13.2 45.9,15.5 R11.2
  Bottom 0.406: v50.2,28.9 50.2,24.9 52.4,22.7 52.4,17.1 50.6,15.3 48.2,12.9 v48.2,12.5 48.1,9.3 48.1,8.4 49.1,7.4 58.4,7.4 60.6,5.2 60.6,2.67 JP6.4
PC4/ADC4/SDA
  Top 0.406: U1.27 52.12,28.38 55.4,25.1 58.1,25.1 59.6,23.6 59.6,9.1 59.6,8.2 63.1,4.7 63.1,2.63 JP6.5
PC5/ADC5/SCL
  Top 0.406: U1.28 52.92,28.88 55.6,26.2 59.5,26.2 60.9,24.8 60.9,10.1 60.9,9.5 65.6,4.8 65.6,2.59 JP6.6
PD0/RXD  (via drill 0.4 pad 1.27, 0.6 pad 1.27)
  Top 0.406: R4.2 34.3,31.2 37.8,27.7 39.7,27.7 40.6,28.6 43.3,28.6 v45.2,30.5 | U1.30 54.6,31.68 54.6,29.3 55.5,28.4 62.1,28.4 62.2,28.5 62.71,29 65.8,32 65.8,39.3 | JP5.1 71.64,49.24 65.8,40.4 65.8,39.3 | v67.4,39.4 65.9,39.4 65.8,39.3
  Bottom 0.406: v45.2,30.5 45.2,31.9 44.4,32.7 44.4,33.7 45.7,35 50.9,35 55.6,40.5 66.3,40.5 v67.4,39.4
PD1/TXD  (via drill 0.6 pad 1.27)
  Top 0.406: U1.31 55.32,29.78 55.9,29.2 56.4,29.2 57.8,30.6 63.2,30.6 65,32.4 65,41.1 69.2,48.3 69.1,49.7 JP5.2 | R5.2 33.2,39.6 v34.6,39.6
  Bottom 0.406: v34.6,39.6 40.6,39.6 49.9,46.1 67.3,46.3 68.9,48.5 69,49.4 JP5.2
PD2/INT0
  Top 0.406: JP5.3 66.16,48.76 64.3,43.5 64.3,33 62.7,31.4 57.3,31.4 56.1,30.2 56.1,31.74 U1.32
PD3/INT1/OC2B
  Top 0.406: U1.1 58.65,33.25 59.7,32.2 62.3,32.2 63.5,33.4 63.5,44.9 63.5,48.8 64,49.52 JP5.4
PD4/T0
  Top 0.406: U1.2 58.95,34.05 59.7,33.3 62,33.3 62.7,34 62.7,46.6 62,48.7 61.4,49.08 JP5.5
PD5/T1/OC0B
  Top 0.5: U1.9 56.12,42.62 58.9,48.8 58.9,49.44 JP5.6
PD6/OC0A/AIN0
  Top 0.5: U1.10 55.32,44.12 56.3,48.5 JP5.7
PD7/AIN1
  Top 0.5: U1.11 54.52,47.82 54.3,50.4 54.3,50.74 JP5.8
RADIO_SEL_N  (via drill 0.4 pad 1.02)
  Top 0.254: U4.23 30.37,16.27 v31.8,17.1
  Top 0.305: v38.4,15.7 38.4,15.9 R12.1
  Top 0.406: R11.1 38.6,15.5 v38.4,15.7
  Bottom 0.305: v31.8,17.1 31.1,16 31.6,15.5 v38.4,15.7
RESET_N  (via drill 0.6 pad 1.27, 0.61 pad 1.02)
  Top 0.406: v32.7,32.9 32.1,33.7 C8.1 | U1.29 53.72,29.08 55.5,27.3 v62.2,27.3 63.99,25.5 63.99,24.7 | v50.2,8.7 45.1,6.8 39.8,6.8 35.95,2.95 JP2.6 | 63.99,24.7 S2.3 S2.4 | ICSP.5 64.03,24.66 63.99,24.7
  Top 0.61: R25.1 31.6,34.5 v32.7,32.9
  Bottom 0.406: v32.7,32.9 31,33.7 30.1,32.8 30.1,13 30.5,12.2 32.1,12.2 33,11.7 33,5.5 33.75,3.45 35.04,3.45 JP2.6 | v50.2,8.7 53.4,8.8 57.6,8.7 58.4,9.1 62.3,13 62.3,27.2 v62.2,27.3
RF_VCC  (via drill 0.4 pad 1.02)
  Top 0.254: U4.15 28.29,10.81 v28.7,10.4
  Top 0.305: v24.5,6 24.73,7.7 R3.2 | C13.1 31.98,10.92 v31.7,11.2
  Top 0.406: 26.88,26.08 27.9,27.1 34.7,27.1 37,24.8 37,13.4 34.6,11 C11.1
  Top 0.61: C13.1 32.11,9.55 C11.1 34.4,9.75 | JP1.1 25.65,28.15 27,26.8 27,25.35 FB1.2 26.88,26.08
  Bottom 0.305: v24.5,6 28.7,7.7 v28.7,10.4 29.5,11.2 v31.7,11.2
SCLK  (via drill 0.4 pad 1.27)
  Top 0.254: R13.1 39.3,13.8 | U4.19 30.73,14.27 31.9,13.1 v33.3,13.1
  Top 0.305: v38,12.4 38.1,12.4
  Top 0.61: 38.1,12.4 R14.1 | 39.3,13.8 v38,12.4
  Bottom 0.305: v33.3,13.1 34.2,13 34.9,13.2 36.6,13 v38,12.4
SLP_TR
  Top 0.254: U4.11 26.29,10.78 R3.1
  Top 0.406: R3.1 23.31,9.51 22.6,8.8 22.6,5.4 23.1,4.9 34.1,4.9 34.2,4.9 35.9,4.9 R17.1 | 39.5,8.3 R17.1 | R17.1 R18.1